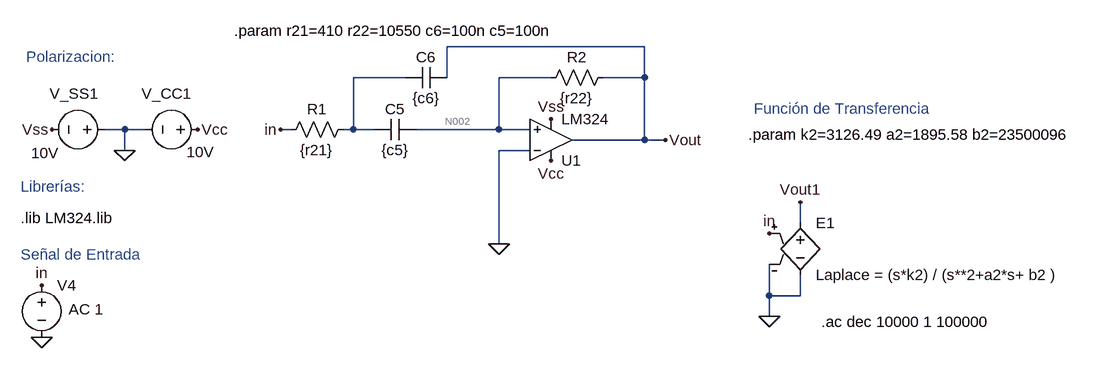
[diagram p0: schematic TP4_realimentacion negativa.asc]
TP4_realimentacion negativa.asc, the LTspice schematic file:
Version 4
SHEET 1 940 680
WIRE -16 -32 -320 -32
WIRE -384 16 -464 16
WIRE -320 16 -320 -32
WIRE -160 16 -240 16
WIRE -16 16 -16 -32
WIRE -16 16 -80 16
WIRE -816 96 -848 96
WIRE -784 96 -816 96
WIRE -560 96 -576 96
WIRE -464 96 -464 16
WIRE -464 96 -480 96
WIRE -432 96 -464 96
WIRE -240 96 -240 16
WIRE -240 96 -368 96
WIRE -192 96 -240 96
WIRE -16 112 -16 16
WIRE -16 112 -128 112
WIRE 16 112 -16 112
WIRE -816 128 -816 96
WIRE -192 128 -240 128
WIRE 224 240 224 208
WIRE -240 272 -240 128
WIRE 176 352 176 304
WIRE 224 352 224 320
WIRE 224 352 176 352
WIRE 176 384 176 352
FLAG -240 272 0
FLAG 16 112 Vout
FLAG -160 80 Vss
FLAG 176 384 0
FLAG -944 416 0
FLAG -944 336 in
FLAG -576 96 in
FLAG 176 256 in
FLAG 224 208 Vout1
FLAG -160 144 Vcc
FLAG -704 96 Vcc
FLAG -928 96 Vss
FLAG -816 128 0
SYMBOL cap -320 0 R90
WINDOW 0 0 32 VBottom 2
WINDOW 3 32 32 VTop 2
SYMATTR InstName C6
SYMATTR Value {c6}
SYMBOL res -176 32 R270
WINDOW 0 32 56 VTop 2
WINDOW 3 0 56 VBottom 2
SYMATTR InstName R2
SYMATTR Value {r22}
SYMBOL res -576 112 R270
WINDOW 0 32 56 VTop 2
WINDOW 3 0 56 VBottom 2
SYMATTR InstName R1
SYMATTR Value {r21}
SYMBOL voltage -944 320 R0
WINDOW 123 42 53 Left 2
WINDOW 39 0 0 Left 0
SYMATTR Value2 AC 1
SYMATTR InstName V4
SYMATTR Value ""
SYMBOL e 224 224 R0
SYMATTR InstName E1
SYMATTR Value Laplace = (s*k2) / (s**2+a2*s+ b2 )
SYMBOL voltage -688 96 R90
WINDOW 0 -55 25 VRight 2
WINDOW 3 35 -10 VRight 2
WINDOW 123 0 0 Left 0
WINDOW 39 0 0 Left 0
SYMATTR InstName V_CC1
SYMATTR Value 10V
SYMBOL voltage -832 96 R90
WINDOW 0 -55 25 VRight 2
WINDOW 3 36 85 VRight 2
WINDOW 123 0 0 Left 0
WINDOW 39 0 0 Left 0
SYMATTR InstName V_SS1
SYMATTR Value 10V
SYMBOL OpAmps\\opamp2 -160 176 M180
SYMATTR InstName U1
SYMATTR Value LM324
SYMBOL cap -368 80 R90
WINDOW 0 0 32 VBottom 2
WINDOW 3 32 32 VTop 2
SYMATTR InstName C5
SYMATTR Value {c5}
TEXT 256 392 Left 2 !.ac dec 10000 1 100000
TEXT 144 104 Left 2 !.param k2=3126.49 a2=1895.58 b2=23500096
TEXT -648 -56 Left 2 !.param r21=410 r22=10550 c6=100n c5=100n
TEXT -976 232 Left 2 !.lib LM324.lib
TEXT -976 184 Left 2 ;Librerías:
TEXT -968 -16 Left 2 ;Polarizacion:
TEXT -976 288 Left 2 ;Señal de Entrada
TEXT 152 64 Left 2 ;Función de Transferencia

The netlist it stands for:
* TP4_realimentacion negativa.asc
C6 Vout N001 {c6}
R2 N002 Vout {r22}
R1 in N001 {r21}
V4 in 0 AC 1
E1 Vout1 0 in 0 Laplace = (s*k2) / (s**2+a2*s+ b2 )
V_CC1 Vcc 0 10V
V_SS1 0 Vss 10V
XU1 N002 0 Vcc Vss Vout LM324  ; pins In+ In- V+ V- OUT
C5 N002 N001 {c5}
.ac dec 10000 1 100000
.param k2=3126.49 a2=1895.58 b2=23500096
.param r21=410 r22=10550 c6=100n c5=100n
.lib LM324.lib
* Librerías:
* Polarizacion:
* Señal de Entrada
* Función de Transferencia
.backanno
.end

* Results of the author's LTspice run, read from the files saved beside the schematic
* Operating Point, zero values left out:
*   V(vout) = -176.5 µV
*   V(n002) = 33.66 µV
*   V(vcc) = 10 V
*   V(vss) = -10 V
*   I(R2) = 19.92 nA
*   I(V_ss1) = -669.8 µA
*   I(V_cc1) = -669.9 µA
*   Ix(u1:1) = -19.92 nA
*   Ix(u1:2) = -19.94 nA
*   Ix(u1:3) = 669.9 µA
*   Ix(u1:4) = -669.8 µA
*   Ix(u1:5) = 19.92 nA
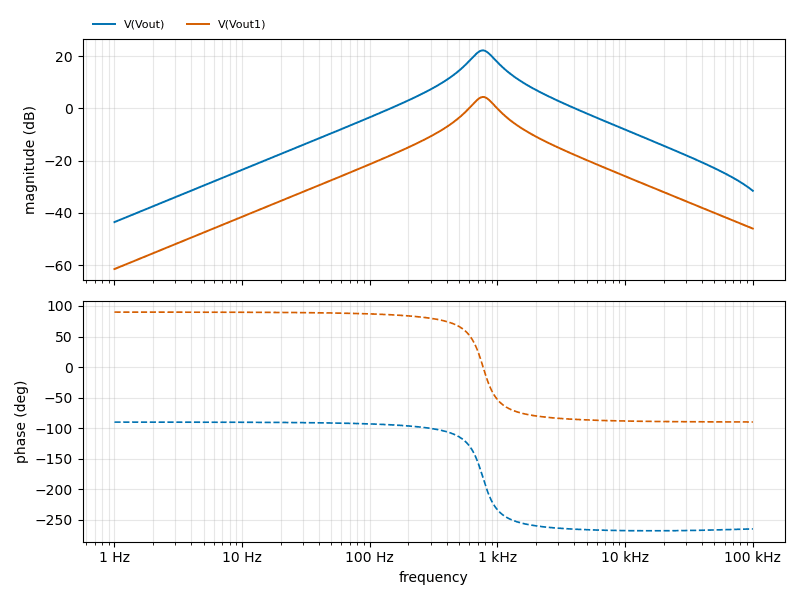
[diagram p1: AC Analysis of TP4_realimentacion negativa.asc, plotted from the saved traces]
* AC Analysis, 1 run:
*   V(Vout): -43.57 dB at 1 Hz, -31.58 dB at 100 kHz, peak 22.19 dB at 766.7 Hz, 3 dB below the peak at 630.1 Hz and 933 Hz
*   V(Vout1): -61.56 dB at 1 Hz, -46.06 dB at 100 kHz, peak 4.35 dB at 771.6 Hz, 3 dB below the peak at 635.3 Hz and 937 Hz